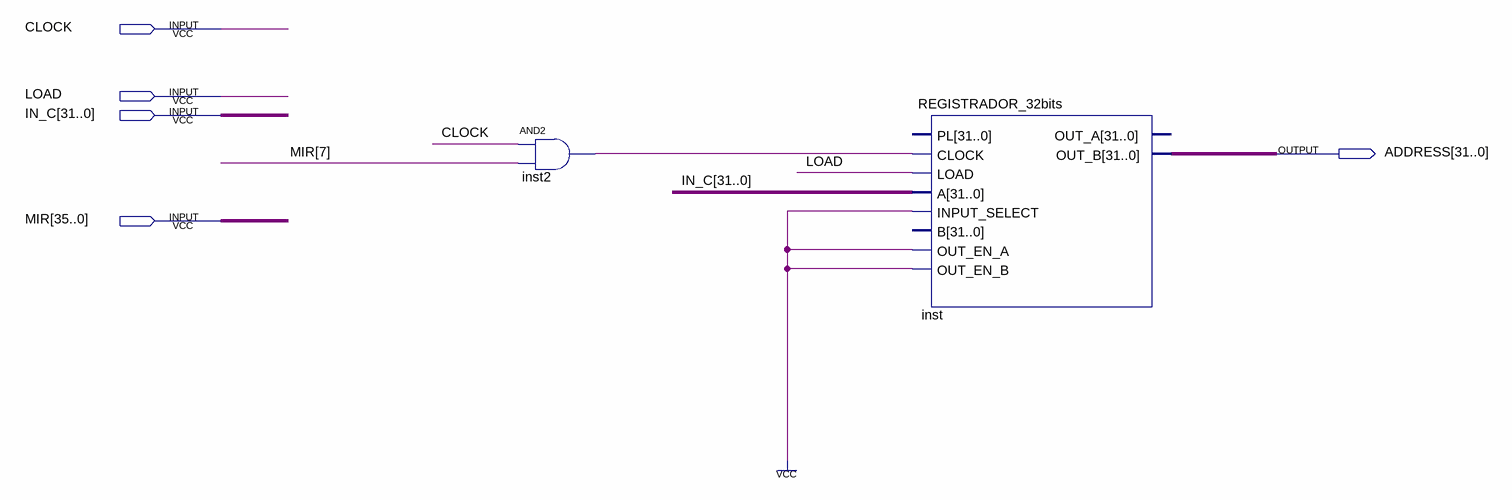
[diagram p0: schematic sheet]
// Quartus schematic MAR.bdf as structural Verilog: 2 symbols, 5 pins
module MAR (
  input  CLOCK,
  input  LOAD,
  input  [31:0] IN_C,
  input  [35:0] MIR,
  output [31:0] ADDRESS
);

  wire inst2_out;

  and inst2 (inst2_out, CLOCK, MIR[7]);
  REGISTRADOR_32bits inst (
    .CLOCK(inst2_out), .LOAD(LOAD), .A(IN_C), .INPUT_SELECT(1'b1), .OUT_EN_A(1'b1), .OUT_EN_B(1'b1),
    .OUT_B(ADDRESS));  // open: PL, B, OUT_A
endmodule
